# EAGLE schematic rail.crossing (EAGLE 6.1)
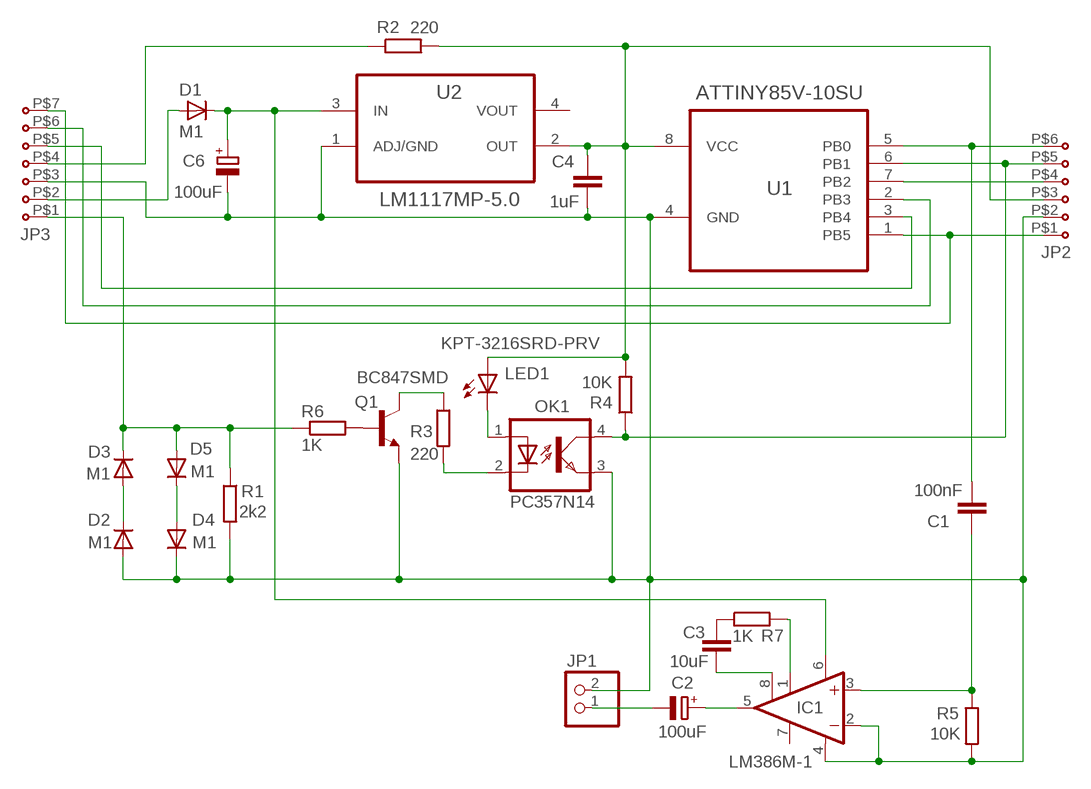
[diagram p0: schematic, sheet 1]

## Parts
C1  100nF  C-EUC1206  [C1206]
C2  100uF  CPOL-EUSMCC  [SMC_C]
C3  10uF  C-EUC1206  [C1206]
C4  1uF  C-EUC0402  [C0402]
C6  100uF  CPOL-EUSMCC  [SMC_C]
D1  M1  ES2D  [SMB]
D2  M1  ES2D  [SMB]
D3  M1  ES2D  [SMB]
D4  M1  ES2D  [SMB]
D5  M1  ES2D  [SMB]
IC1  LM386M-1  [SO08]
JP1  PINHD-1X2/90  [1X02/90]
JP2  J6SMD  [JP6SMD]
JP3  J7SMD  [JP7SMD]
LED1  KPT-3216SRD-PRV  LEDSML1206  [SML1206]
OK1  PC357N14  LTV816S  [SMD4]
Q1  BC847SMD  [SOT23]
R1  2k2  R-EU_R1206  [R1206]
R2  220  R-EU_R1206  [R1206]
R3  220  R-EU_R1206  [R1206]
R4  10K  R-EU_R1206  [R1206]
R5  10K  R-EU_R1206  [R1206]
R6  1K  R-EU_R1206  [R1206]
R7  1K  R-EU_M1206  [M1206]
U1  ATTINY85V-10SU  [SOIC127P798X216-8N]
U2  LM1117MP-5.0  [SOT230P696X180-4N]

## Nets
220: LED1.C OK1.1(A)
JP1: D3.C D5.A JP3.P$1 R1.1 R6.1
JP2: C4.2 C6.- D2.A D4.C IC1.2(-IN) IC1.4(GND) JP1.2 JP2.P$2 JP3.P$3 OK1.3(EMIT) Q1.2(E) R1.2 R5.2 U1.4(GND) U2.1(ADJ/GND)
N$1: C2.- JP1.1
N$2: C3.1 R7.1
N$3: C3.2 IC1.8(GAIN)
N$4: D2.C D3.A
N$5: D4.A D5.C
N$6: Q1.1(B) R6.2
N$7: Q1.3(C) R3.1
N$8: C2.+ IC1.5(OUT)
N$9: OK1.2(C) R3.2
N$10: JP2.P$4 U1.7(PB2)
N$11: C1.1 JP2.P$6 U1.5(PB0)
N$12: JP3.P$4 R2.1
N$14: JP2.P$5 OK1.4(COL) R4.1 U1.6(PB1)
N$16: IC1.1(GAIN) R7.2
N$17: C1.2 IC1.3(+IN) R5.1
N$21: D1.A JP3.P$2
N$22: C6.+ D1.C IC1.6(VS) U2.3(IN)
N$23: C4.1 JP2.P$3 LED1.A R2.2 R4.2 U1.8(VCC) U2.2(OUT)
RED1: JP3.P$6 U1.2(PB3)
RED2: JP3.P$5 U1.3(PB4)
WHITE: JP2.P$1 JP3.P$7 U1.1(PB5)
Unconnected: IC1.7(BYPASS) U2.4(VOUT)

## Library data of the parts
C1 C3 C4 = rcl:C-EU: CAPACITOR, European symbol
C2 C6 = rcl:CPOL-EU: POLARIZED CAPACITOR, European symbol
D1-D5 = diode:ES2D: DIODE super fast rectifier, 2 A
IC1 = linear:LM386?-*: Low Voltage Audio Power Amplifier Source: http://cache.national.com/ds/LM/LM386.pdf
JP1 = pinhead:PINHD-1X2: PIN HEADER
JP2 = jumper:J6SMD
JP3 = jumper:J7SMD
LED1 = led:LED: LED OSRAM: - CHIPLED LG R971, LG N971, LY N971, LG Q971, LY Q971, LO R971, LY R971 LH N974, LH R974 LS Q976, LO Q976, LY Q976 LO Q996 - Hyper CHIPLED LW Q18S LB Q993, LB Q99A, LB R99A - SideLED LS A670, LO A670, LY A670, LG A670, LP A670 LB A673, LV A673, LT A673, LW A673 LH A674 LY A675 LS A676, LA A676, LO A676, LY A676, LW A676 LS A679, LY A679, LG A679 - Hyper Micro SIDELED® LS Y876, LA Y876, LO Y876, LY Y876 LT Y87S - SmartLED LW L88C, LW L88S LB L89C, LB L89S, LG L890 LS L89K, LO L89K, LY L89K LS L896, LA L896, LO L896, LY L896 - TOPLED LS T670, LO T670, LY T670, LG T670, LP T670 LSG T670, LSP T670, LSY T670, LOP T670, LYG T670 LG T671, LOG T671, LSG T671 LB T673, LV T673, LT T673, LW T673 LH T674 LS T676, LA T676, LO T676, LY T676, LB T676, LH T676, LSB T676, LW T676 LB T67C, LV T67C, LT T67C, LS T67K, LO T67K, LY T67K, LW E67C LS E67B, LA E67B, LO E67B, LY E67B, LB E67C, LV E67C, LT E67C LW T67C LS T679, LY T679, LG T679 LS T770, LO T770, LY T770, LG T770, LP T770 LB T773, LV T773, LT T773, LW T773 LH T774 LS E675, LA E675, LY E675, LS T675 LS T776, LA T776, LO T776, LY T776, LB T776 LHGB T686 LT T68C, LB T68C - Hyper Mini TOPLED® LB M676 - Mini TOPLED Santana® LG M470 LS M47K, LO M47K, LY M47K Source: http://www.osram.convergy.de LUXEON: - LUMILED® LXK2-PW12-R00, LXK2-PW12-S00, LXK2-PW14-U00, LXK2-PW14-V00 LXK2-PM12-R00, LXK2-PM12-S00, LXK2-PM14-U00 LXK2-PE12-Q00, LXK2-PE12-R00, LXK2-PE12-S00, LXK2-PE14-T00, LXK2-PE14-U00 LXK2-PB12-K00, LXK2-PB12-L00, LXK2-PB12-M00, LXK2-PB14-N00, LXK2-PB14-P00, LXK2-PB14-Q00 LXK2-PR12-L00, LXK2-PR12-M00, LXK2-PR14-Q00, LXK2-PR14-R00 LXK2-PD12-Q00, LXK2-PD12-R00, LXK2-PD12-S00 LXK2-PH12-R00, LXK2-PH12-S00 LXK2-PL12-P00, LXK2-PL12-Q00, LXK2-PL12-R00 Source: www.luxeon.com KINGBRIGHT: KA-3528ASYC Source: www.kingbright.com
OK1 = optocoupler:LTV816: OPTO COUPLER Source: LITEON, LTV816.pdf; OC_FARNELL: unknown; OC_NEWARK: unknown
Q1 = transistor-npn:BC847*: NPN Transistor
R1-R7 = rcl:R-EU_: RESISTOR, European symbol
U1 = Attiny85:ATTINY85V-10SU: 8-bit Microcontroller with In-System Programmable Flash; MPN: ATTINY85V-10SU; OC_FARNELL: 1455166; OC_NEWARK: 58M3799; PACKAGE: SOIC-8; SUPPLIER: Atmel
U2 = LM1117:LM1117MP-5.0: Linear regulators; MPN: LM1117MP-5.0; OC_FARNELL: 9778209; OC_NEWARK: 41K3471; PACKAGE: SOT223-3; SUPPLIER: NationalSemiconductor